# Altium schematic sheet Divider.SchDoc
size B; Organization: Mechanart, LLC; Address1: 397 Laurie Meadows Drive; Address2: Apt. 437; Address3: San Mateo, CA 94403
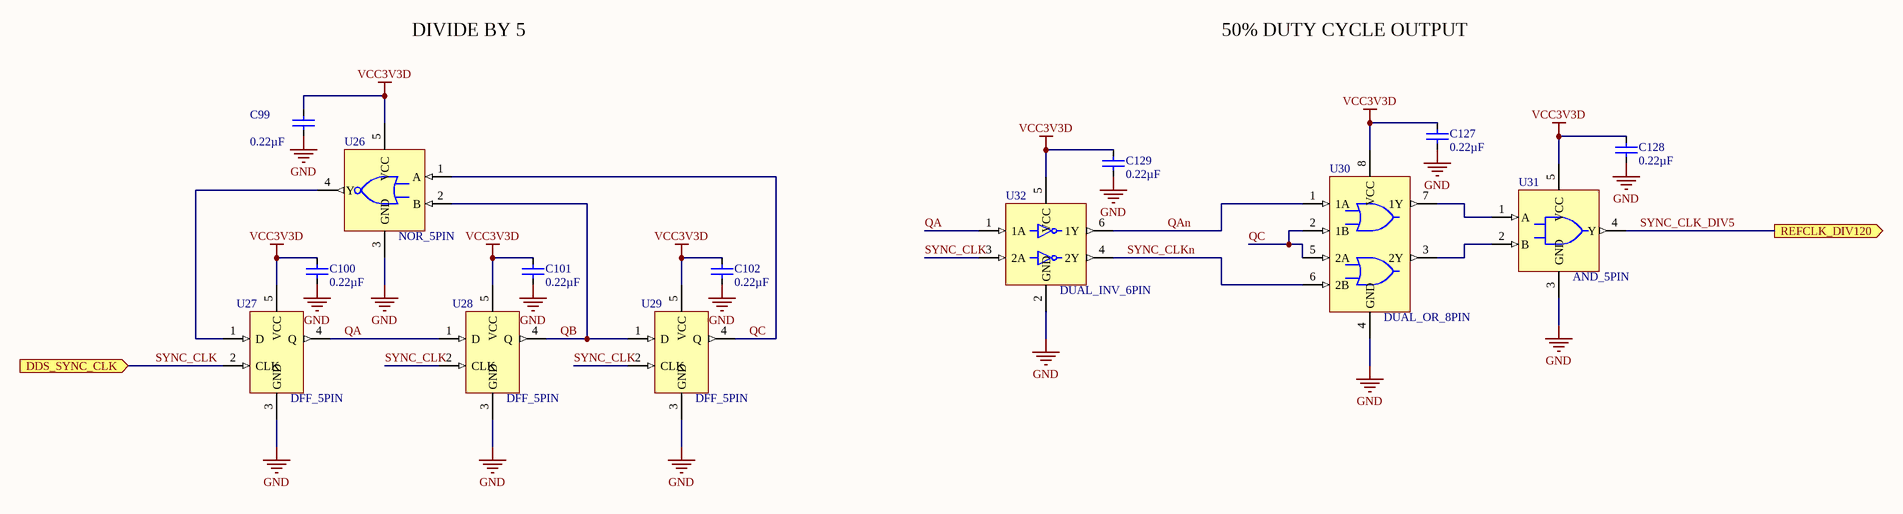
[diagram p0: Divider.SchDoc]

## Parts
C99  0.22µF  [CAPC1005X50L25N]
C100  0.22µF  [CAPC1005X50L25N]
C101  0.22µF  [CAPC1005X50L25N]
C102  0.22µF  [CAPC1005X50L25N]
C127  0.22µF  [CAPC1005X50L25N]
C128  0.22µF  [CAPC1005X50L25N]
C129  0.22µF  [CAPC1005X50L25N]
U26  NOR_5PIN  [SOT65P210X90-5L20N]
U27  DFF_5PIN  [SOT65P210X90-5L20N]
U28  DFF_5PIN  [SOT65P210X90-5L20N]
U29  DFF_5PIN  [SOT65P210X90-5L20N]
U30  DUAL_OR_8PIN  [SOP50P310X90-8L15N]
U31  AND_5PIN  [SOT65P210X90-5L20N]
U32  DUAL_INV_6PIN  [SOT65P210X110-6L20N]

## Ports
DDS_SYNC_CLK (in), REFCLK_DIV120 (out)

## Nets
GND: C99.2 C100.2 C101.2 C102.2 C127.2 C128.2 C129.2 U26.3(GND) U27.3(GND) U28.3(GND) U29.3(GND) U30.4(GND) U31.3(GND) U32.2(GND)
VCC3V3D: C99.1 C100.1 C101.1 C102.1 C127.1 C128.1 C129.1 U26.5(VCC) U27.5(VCC) U28.5(VCC) U29.5(VCC) U30.8(VCC) U31.5(VCC) U32.5(VCC)
QA: U27.4(Q) U28.1(D) U32.1(1A)
QAn: U30.1(1A) U32.6(1Y)
QB: U26.2(B) U28.4(Q) U29.1(D)
QC: U26.1(A) U29.4(Q) U30.2(1B) U30.5(2A)
SYNC_CLK: U27.2(CLK) U28.2(CLK) U29.2(CLK) U32.3(2A) ; port DDS_SYNC_CLK
SYNC_CLK_DIV5: U31.4(Y) ; port REFCLK_DIV120
SYNC_CLKn: U30.6(2B) U32.4(2Y)
NetU26_4: U26.4(Y) U27.1(D)
NetU30_3: U30.3(2Y) U31.2(B)
NetU30_7: U30.7(1Y) U31.1(A)

## Notes on the sheet
- DIVIDE BY 5
- 50% DUTY CYCLE OUTPUT
- Title
- Size:
- Date:
- B
- Number:
- Time:
- Revision:
- Sheet
- of
- File:

## Library data of the parts
C99-C102 C127-C129 = GRT155R6YA224KE01D: CAP CER 0.22UF 35V 10% X5R 0402; Manufacturer: Murata Electronics North America; Design Item Id: GRT155R6YA224KE01D; Supplier 1: Digi-Key; Supplier Part Number 1: 490-12271-1-ND; Manufacturer Part Number: GRT155R6YA224KE01D; RoHS: RoHS Compliant; Category: Capacitors; Stock 1: 8428; Pricing 1: 1=0.1, 10=0.054, 50=0.0292, 100=0.0248, 250=0.02024, 500=0.01732, 1000=0.0135, 5000=0.01125 (USD); Packaging: Cut Tape (CT); Applications: Automotive; Operating Temperature: -55°C ~ 85°C; Mounting Type: Surface Mount, MLCC; Package / Case: 0402 (1005 Metric); ComponentLink1URL: http://search.murata.co.jp/Ceramy/image/img/A01X/G101/ENG/GRT155R6YA224KE01-01.pdf; ComponentLink1Description: http://search.murata.co.jp/Ceramy/image/img/A01X/G101/ENG/GRT155R6YA224KE01-01.pdf; Capacitance: 0.22µF; Tolerance: ±10%; Voltage - Rated: 35V; Temperature Coefficient: X5R; Ratings: AEC-Q200; Size / Dimension: 0.039" L x 0.020" W (1.00mm x 0.50mm); Height - Seated (Max): -; Thickness (Max): 0.022" (0.55mm); Lead Spacing: -; Features: Derating Recommended; Lead Style: -
U26 = SN74AUP1T02DCKR: IC GATE NOR 1CH 2-INP SC-70-5; Manufacturer: Texas Instruments; Logic Type: NOR Gate; Current - Output High, Low: 4mA, 4mA; Max Propagation Delay @ V, Max CL: 4.4ns @ 3.3V, 30pF; Voltage - Supply: 2.3 V ~ 3.6 V; Number of Circuits: 1; Number of Inputs: 2; Current - Quiescent (Max): 0.5µA; Logic Level - Low: 0.35 V ~ 0.5 V; Logic Level - High: 1.1 V ~ 1.19 V; Design Item Id: SN74AUP1T02DCKR; Supplier 1: Digi-Key; Supplier Part Number 1: 296-27389-1-ND; Manufacturer Part Number: SN74AUP1T02DCKR; RoHS: RoHS Compliant; Category: Integrated Circuits (ICs); Stock 1: 6420; Pricing 1: 1=0.36, 10=0.29, 100=0.198, 500=0.1482, 1000=0.111 (USD); Packaging: Cut Tape (CT); Operating Temperature: -40°C ~ 85°C; Mounting Type: Surface Mount; Package / Case: 5-TSSOP, SC-70-5, SOT-353; Supplier Device Package: SC-70-5; ComponentLink1URL: http://www.ti.com/lit/ds/symlink/sn74aup1t02.pdf; ComponentLink1Description: http://www.ti.com/lit/ds/symlink/sn74aup1t02.pdf; Features: Schmitt Trigger
U27-U29 = SN74AUP1G79DCKR: IC D-TYPE POS TRG SNGL SC70-5; Manufacturer: Texas Instruments; Number of Elements: 1; Current - Output High, Low: 4mA, 4mA; Function: Standard; Output Type: Non-Inverted; Frequency - Clock: 266MHz; Max Propagation Delay @ V, Max CL: 5.8ns @ 3.3V, 30pF; Trigger Type: Positive Edge; Voltage - Supply: 0.8 V ~ 3.6 V; Current - Quiescent: 0.5µA; Input Capacitance: 1.5pF; Design Item Id: SN74AUP1G79DCKR; Supplier 1: Digi-Key; Supplier Part Number 1: 296-17660-1-ND; Manufacturer Part Number: SN74AUP1G79DCKR; RoHS: RoHS Compliant; Category: Integrated Circuits (ICs); Stock 1: 8359; Pricing 1: 1=0.48, 10=0.365, 100=0.2274, 500=0.15544, 1000=0.11948 (USD); Packaging: Cut Tape (CT); Operating Temperature: -40°C ~ 85°C (TA); Mounting Type: Surface Mount; Package / Case: 5-TSSOP, SC-70-5, SOT-353; ComponentLink1URL: http://www.ti.com/lit/ds/symlink/sn74aup1g79.pdf; ComponentLink1Description: http://www.ti.com/lit/ds/symlink/sn74aup1g79.pdf; Number of Bits per Element: 1; Type: D-Type
U30 = SN74AUP2G32DCUR: IC GATE OR 2CH 2-INP US8; Manufacturer: Texas Instruments; Logic Type: OR Gate; Current - Output High, Low: 4mA, 4mA; Max Propagation Delay @ V, Max CL: 6.2ns @ 3.3V, 30pF; Voltage - Supply: 0.8 V ~ 3.6 V; Number of Circuits: 2; Current - Quiescent (Max): 0.5µA; Logic Level - Low: 0.7 V ~ 0.9 V; Logic Level - High: 1.6 V ~ 2 V; Design Item Id: SN74AUP2G32DCUR; Supplier 1: Digi-Key; Supplier Part Number 1: 296-32275-1-ND; Manufacturer Part Number: SN74AUP2G32DCUR; RoHS: RoHS Compliant; Category: Integrated Circuits (ICs); Stock 1: 19917; Pricing 1: 1=0.62, 10=0.544, 100=0.416, 500=0.3296, 1000=0.264 (USD); Packaging: Cut Tape (CT); Operating Temperature: -40°C ~ 85°C; Mounting Type: Surface Mount; Package / Case: 8-VFSOP (0.091", 2.30mm Width); Supplier Device Package: US8; ComponentLink1URL: http://www.ti.com/lit/ds/symlink/sn74aup2g32.pdf; ComponentLink1Description: http://www.ti.com/lit/ds/symlink/sn74aup2g32.pdf; Number of Inputs: 2; Features: -
U31 = SN74AUP1T08DCKR: IC GATE AND 1CH 2-INP SC-70-5; Manufacturer: Texas Instruments; Logic Type: AND Gate; Current - Output High, Low: 4mA, 4mA; Max Propagation Delay @ V, Max CL: 4.4ns @ 3.3V, 30pF; Voltage - Supply: 2.3 V ~ 3.6 V; Number of Circuits: 1; Number of Inputs: 2; Current - Quiescent (Max): 0.5µA; Logic Level - Low: 0.35 V ~ 0.5 V; Logic Level - High: 1.1 V ~ 1.19 V; Design Item Id: SN74AUP1T08DCKR; Supplier 1: Digi-Key; Supplier Part Number 1: 296-27391-1-ND; Manufacturer Part Number: SN74AUP1T08DCKR; RoHS: RoHS Compliant; Category: Integrated Circuits (ICs); Stock 1: 3388; Pricing 1: 1=0.36, 10=0.29, 100=0.198, 500=0.1482, 1000=0.111 (USD); Packaging: Cut Tape (CT); Operating Temperature: -40°C ~ 85°C; Mounting Type: Surface Mount; Package / Case: 5-TSSOP, SC-70-5, SOT-353; Supplier Device Package: SC-70-5; ComponentLink1URL: http://www.ti.com/lit/ds/symlink/sn74aup1t08.pdf; ComponentLink1Description: http://www.ti.com/lit/ds/symlink/sn74aup1t08.pdf; Features: Schmitt Trigger
U32 = SN74AUP2G14DCKR: IC INVERT SCHMIT TRIG DL SC70-6; Manufacturer: Texas Instruments; Logic Type: Inverter; Current - Output High, Low: 4mA, 4mA; Max Propagation Delay @ V, Max CL: 6.2ns @ 3.3V, 30pF; Voltage - Supply: 0.8 V ~ 3.6 V; Number of Circuits: 2; Current - Quiescent (Max): 0.5µA; Logic Level - Low: 0.1 V ~ 0.88 V; Logic Level - High: 0.6 V ~ 2.29 V; Design Item Id: SN74AUP2G14DCKR; Supplier 1: Digi-Key; Supplier Part Number 1: 296-27361-1-ND; Manufacturer Part Number: SN74AUP2G14DCKR; RoHS: RoHS Compliant; Category: Integrated Circuits (ICs); Stock 1: 9021; Pricing 1: 1=0.45, 10=0.387, 100=0.289, 500=0.227, 1000=0.175 (USD); Packaging: Cut Tape (CT); Operating Temperature: -40°C ~ 85°C; Mounting Type: Surface Mount; Package / Case: 6-TSSOP, SC-88, SOT-363; Supplier Device Package: SC-70-6; ComponentLink1URL: http://www.ti.com/lit/ds/symlink/sn74aup2g14.pdf; ComponentLink1Description: http://www.ti.com/lit/ds/symlink/sn74aup2g14.pdf; Number of Inputs: 2; Features: Schmitt Trigger